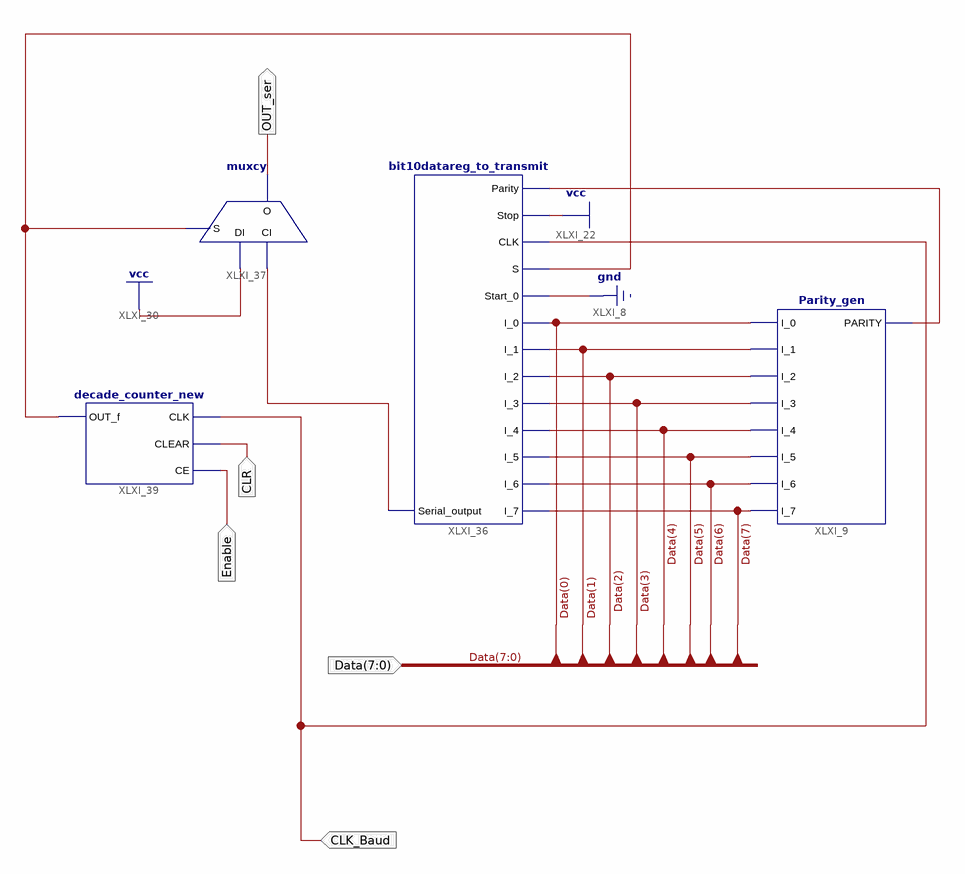
[diagram p0: schematic sheet 1]
// Xilinx ISE schematic usart_transmiter.sch (spartan3e) as structural Verilog: 4 symbols, 5 ports
module usart_transmiter (
  input  CLR,
  input  CLK_Baud,
  input  [7:0] Data,
  input  Enable,
  output OUT_ser
);

  wire XLXN_42, XLXN_77, XLXN_78;

  Parity_gen XLXI_9 (
    .I_0(Data[0]), .I_1(Data[1]), .I_2(Data[2]), .I_3(Data[3]), .I_4(Data[4]), .I_5(Data[5]), .I_6(Data[6]),
    .I_7(Data[7]), .PARITY(XLXN_42));
  bit10datareg_to_transmit XLXI_36 (
    .I_7(Data[7]), .I_6(Data[6]), .I_5(Data[5]), .I_4(Data[4]), .I_3(Data[3]), .I_2(Data[2]), .I_1(Data[1]),
    .I_0(Data[0]), .Start_0(1'b0), .S(XLXN_78), .CLK(CLK_Baud), .Stop(1'b1), .Parity(XLXN_42),
    .Serial_output(XLXN_77));
  muxcy XLXI_37 (.CI(XLXN_77), .DI(1'b1), .S(XLXN_78), .O(OUT_ser));
  decade_counter_new XLXI_39 (.CLK(CLK_Baud), .CLEAR(CLR), .CE(Enable), .OUT_f(XLXN_78));
endmodule
